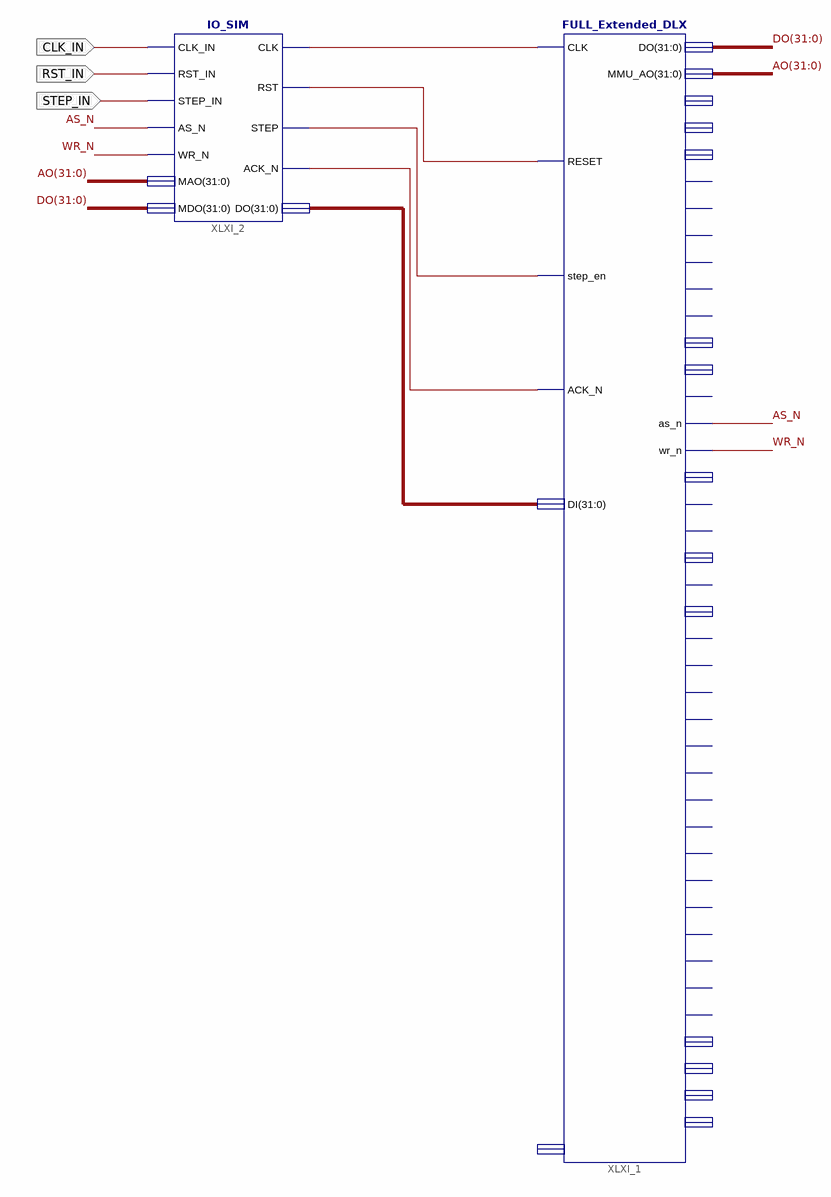
[diagram p0: schematic sheet 1]
// Xilinx ISE schematic FULL_Extended_IOSIMUL.sch (spartan6) as structural Verilog: 2 symbols, 3 ports
module FULL_Extended_IOSIMUL (
  input  CLK_IN,
  input  RST_IN,
  input  STEP_IN
);

  wire AS_N, WR_N, XLXN_6, XLXN_7, XLXN_8, XLXN_9;
  wire [31:0] AO, DO, XLXN_10;

  FULL_Extended_DLX XLXI_1 (
    .CLK(XLXN_6), .RESET(XLXN_7), .step_en(XLXN_8), .ACK_N(XLXN_9), .DI(XLXN_10), .DO(DO), .MMU_AO(AO),
    .as_n(AS_N), .wr_n(WR_N));  // open: AEQZ, IR, ACC_UPDATE, BNN_SEL, func, D, opcode, itype, jlink, mr, mw, isInit, isHalt, ALUF, DLX_STATE, busy, MAC_STATE, stop_n, IRCE, PCCE, ACE, BCE, CCE, MARCE, MDRCE, DINSEL, MDRSEL, ASEL, ADD, TEST, SHIFT, RIGHT, GPRWE, S1SEL, S2SEL, to_reg_C, orig_DINT, Dadr
  IO_SIM XLXI_2 (
    .CLK_IN(CLK_IN), .RST_IN(RST_IN), .STEP_IN(STEP_IN), .AS_N(AS_N), .WR_N(WR_N), .MAO(AO), .MDO(DO),
    .CLK(XLXN_6), .RST(XLXN_7), .STEP(XLXN_8), .ACK_N(XLXN_9), .DO(XLXN_10));
endmodule
